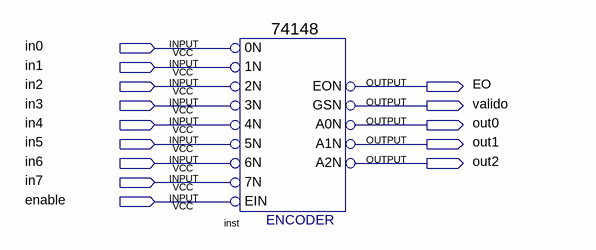
[diagram p0: schematic sheet]
// Quartus schematic PENCOD8to3.bdf as structural Verilog: 1 symbols, 14 pins
module PENCOD8to3 (
  input  in0,
  input  in1,
  input  in2,
  input  in3,
  input  in4,
  input  in5,
  input  in6,
  input  in7,
  input  enable,
  output EO,
  output valido,
  output out0,
  output out1,
  output out2
);

  \74148  inst (
    .\5N (in5), .\0N (in0), .\1N (in1), .\2N (in2), .\3N (in3), .\4N (in4), .EIN(enable), .\6N (in6),
    .\7N (in7), .A1N(out1), .A0N(out0), .A2N(out2), .EON(EO), .GSN(valido));
endmodule
